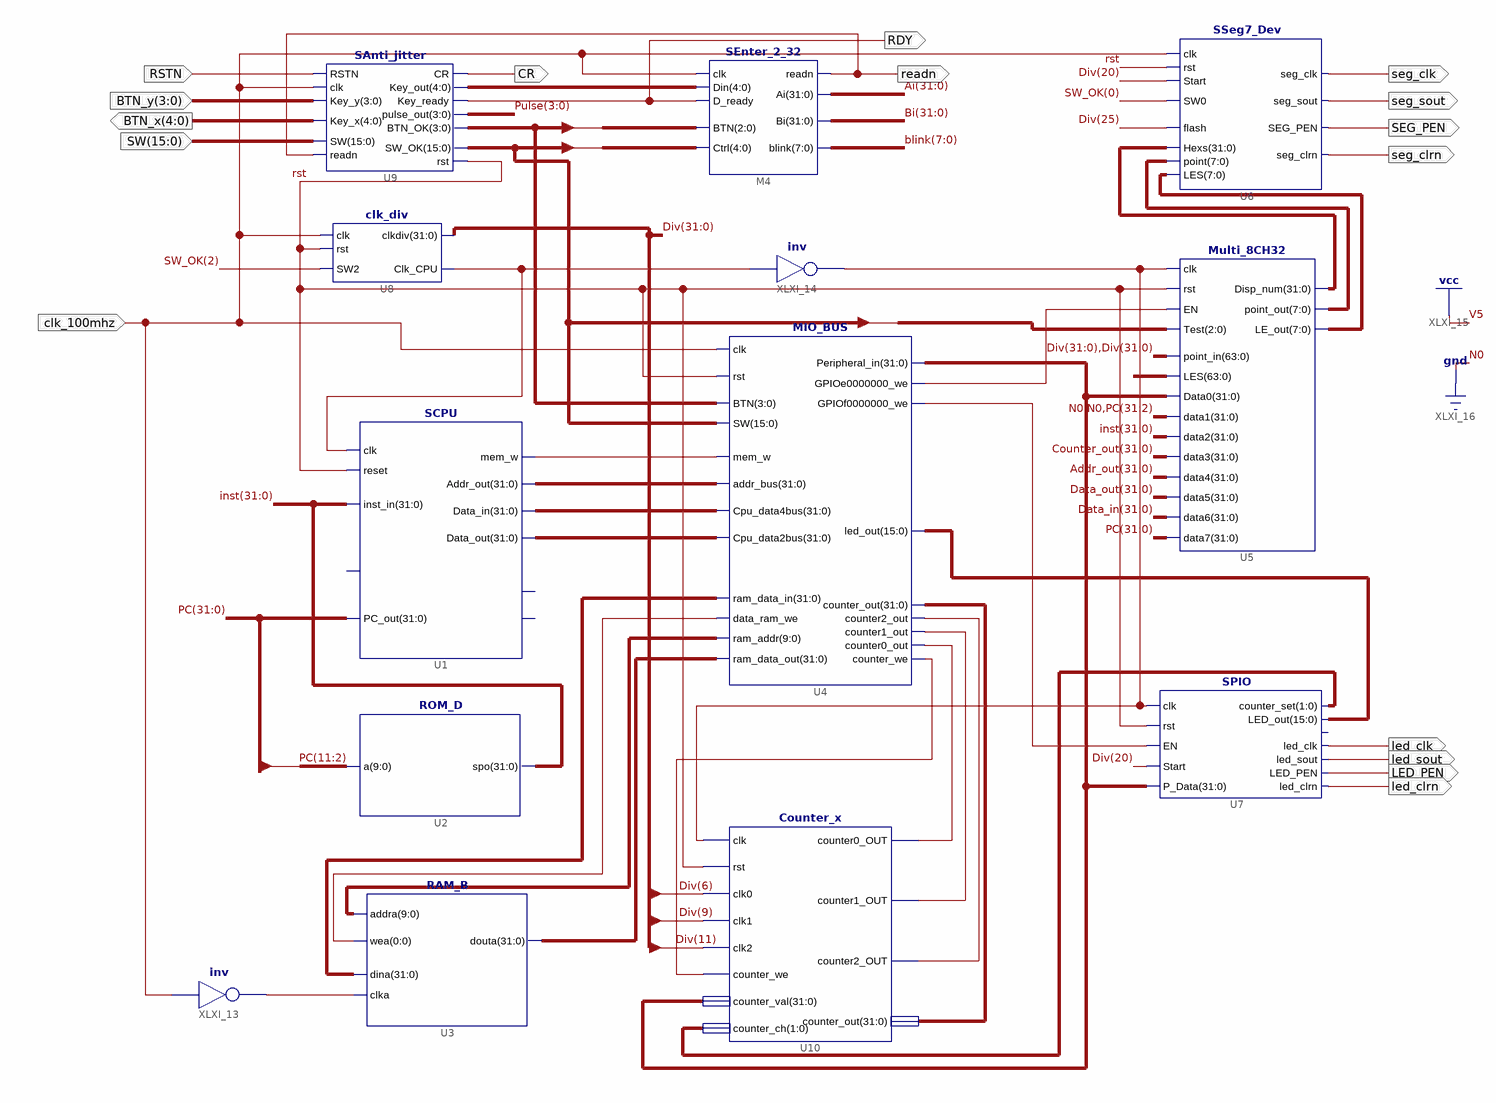
[diagram p0: schematic sheet 1]
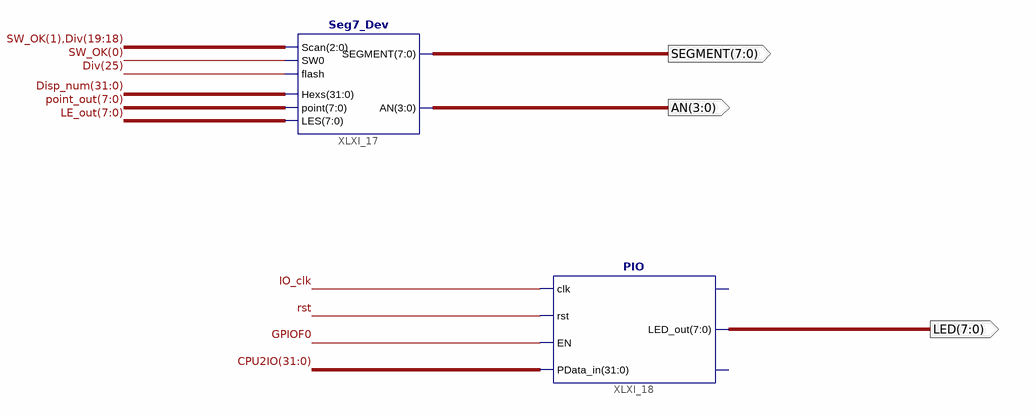
[diagram p1: schematic sheet 2]
// Xilinx ISE schematic Top_SCPU.sch (kintex7) as structural Verilog: 15 symbols, 19 ports
module Top_SCPU (
  input  clk_100mhz,
  input  RSTN,
  input  [3:0] BTN_y,
  input  [15:0] SW,
  output CR,
  output RDY,
  output readn,
  output [4:0] BTN_x,
  output seg_sout,
  output seg_clk,
  output SEG_PEN,
  output seg_clrn,
  output led_sout,
  output led_clk,
  output LED_PEN,
  output led_clrn,
  output [7:0] SEGMENT,
  output [3:0] AN,
  output [7:0] LED
);

  wire GPIOF0, IO_clk, rst, XLXN_1, XLXN_17, XLXN_22, XLXN_72, XLXN_79, XLXN_80, XLXN_81, XLXN_94, XLXN_97,
       XLXN_98;
  wire [0:0] XLXN_14;
  wire [1:0] XLXN_75;
  wire [3:0] BTN_OK, Pulse;
  wire [4:0] XLXN_41;
  wire [7:0] blink, LE_out, point_out;
  wire [9:0] XLXN_13;
  wire [15:0] SW_OK, XLXN_88;
  wire [31:0] Addr_out, Ai, Bi, Counter_out, CPU2IO, Data_in, Data_out, Disp_num, Div, inst, PC, XLXN_15,
       XLXN_37;

  ROM_D U2 (.a(PC[11:2]), .spo(inst));
  RAM_B U3 (.addra(XLXN_13), .clka(XLXN_17), .wea(XLXN_14[0]), .dina(XLXN_15), .douta(XLXN_37));
  SCPU U1 (
    .clk(XLXN_22), .reset(rst), .inst_in(inst), .Addr_out(Addr_out), .mem_w(XLXN_1), .Data_out(Data_out),
    .Data_in(Data_in), .PC_out(PC));  // open: INT, CPU_MIO, MIO_ready
  MIO_BUS U4 (
    .rst(rst), .clk(clk_100mhz), .mem_w(XLXN_1), .addr_bus(Addr_out), .Cpu_data4bus(Data_in),
    .Cpu_data2bus(Data_out), .ram_data_out(XLXN_37), .ram_addr(XLXN_13), .data_ram_we(XLXN_14[0]),
    .ram_data_in(XLXN_15), .counter_out(Counter_out), .counter2_out(XLXN_79), .counter1_out(XLXN_80),
    .counter0_out(XLXN_81), .counter_we(XLXN_72), .BTN(BTN_OK), .SW(SW_OK), .led_out(XLXN_88),
    .Peripheral_in(CPU2IO), .GPIOe0000000_we(XLXN_98), .GPIOf0000000_we(XLXN_97));
  Multi_8CH32 U5 (
    .Test(SW_OK[7:5]), .point_in({Div, Div}), .EN(XLXN_98), .clk(XLXN_94), .rst(rst), .LES({64{1'b0}}),
    .Data0(CPU2IO), .data1({2'b00, PC[31:2]}), .data2(inst), .data3(Counter_out), .data4(Addr_out),
    .data5(Data_out), .data6(Data_in), .data7(PC), .point_out(point_out), .LE_out(LE_out), .Disp_num(Disp_num));
  SPIO U7 (
    .clk(XLXN_94), .P_Data(CPU2IO), .rst(rst), .EN(XLXN_97), .Start(Div[20]), .led_clk(led_clk),
    .LED_out(XLXN_88), .counter_set(XLXN_75), .led_clrn(led_clrn), .LED_PEN(LED_PEN), .led_sout(led_sout));  // open: GPIOf0
  Counter_x U10 (
    .clk(XLXN_94), .rst(rst), .clk0(Div[6]), .clk1(Div[9]), .clk2(Div[11]), .counter_we(XLXN_72),
    .counter_val(CPU2IO), .counter_ch(XLXN_75), .counter0_OUT(XLXN_81), .counter1_OUT(XLXN_80),
    .counter2_OUT(XLXN_79), .counter_out(Counter_out));
  SSeg7_Dev U6 (
    .LES(LE_out), .SEG_PEN(SEG_PEN), .seg_sout(seg_sout), .seg_clrn(seg_clrn), .point(point_out),
    .Hexs(Disp_num), .SW0(SW_OK[0]), .flash(Div[25]), .seg_clk(seg_clk), .clk(clk_100mhz), .rst(rst),
    .Start(Div[20]));
  SEnter_2_32 M4 (
    .readn(readn), .Ai(Ai), .Bi(Bi), .blink(blink), .Din(XLXN_41), .D_ready(RDY), .clk(clk_100mhz),
    .Ctrl({SW_OK[7:5], SW_OK[15], SW_OK[0]}), .BTN(BTN_OK[2:0]));
  SAnti_jitter U9 (
    .SW(SW), .readn(readn), .Key_y(BTN_y), .Key_x(BTN_x), .RSTN(RSTN), .clk(clk_100mhz), .Key_out(XLXN_41),
    .Key_ready(RDY), .CR(CR), .rst(rst), .SW_OK(SW_OK), .pulse_out(Pulse), .BTN_OK(BTN_OK));
  clk_div U8 (.rst(rst), .clk(clk_100mhz), .SW2(SW_OK[2]), .clkdiv(Div), .Clk_CPU(XLXN_22));
  not XLXI_13 (XLXN_17, clk_100mhz);
  not XLXI_14 (XLXN_94, XLXN_22);
  Seg7_Dev XLXI_17 (
    .LES(LE_out), .Scan({SW_OK[1], Div[19:18]}), .SEGMENT(SEGMENT), .AN(AN), .point(point_out),
    .flash(Div[25]), .SW0(SW_OK[0]), .Hexs(Disp_num));
  PIO XLXI_18 (.clk(IO_clk), .rst(rst), .EN(GPIOF0), .PData_in(CPU2IO), .LED_out(LED));  // open: GPIOf0, counter_set
endmodule
